# Altium schematic sheet TopLevel.SchDoc
size A
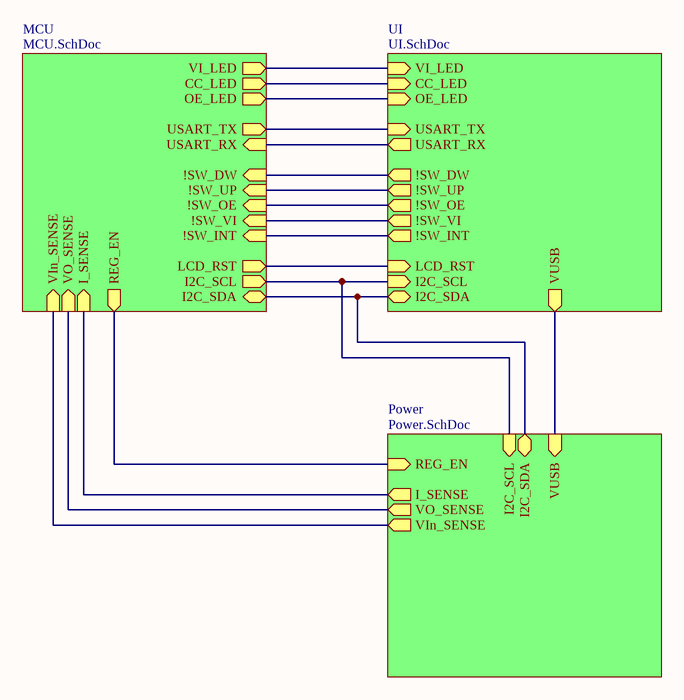
[diagram p0: TopLevel.SchDoc]

## Sub-sheets
MCU = MCU.SchDoc: REG_EN (out), CC_LED (out), OE_LED (out), USART_TX (out), USART_RX (in), !SW_DW (in), I_SENSE (in), VO_SENSE (in), VIn_SENSE (in), !SW_UP (in), !SW_OE (in), !SW_VI (in), !SW_INT (in), I2C_SCL (out), I2C_SDA (bidir), LCD_RST (out), VI_LED (out)
Power = Power.SchDoc: REG_EN (in), I_SENSE (out), VO_SENSE (out), VIn_SENSE (out), VUSB (in), I2C_SCL (in), I2C_SDA (bidir)
UI = UI.SchDoc: CC_LED (in), OE_LED (in), USART_TX (in), USART_RX (out), !SW_DW (out), !SW_UP (out), !SW_OE (out), !SW_VI (out), !SW_INT (out), LCD_RST (in), I2C_SCL (in), I2C_SDA (bidir), VUSB (out), VI_LED (in)

## Nets
(unnamed): sheet MCU/REG_EN, sheet Power/REG_EN
(unnamed): sheet MCU/CC_LED, sheet UI/CC_LED
(unnamed): sheet MCU/OE_LED, sheet UI/OE_LED
(unnamed): sheet MCU/USART_TX, sheet UI/USART_TX
(unnamed): sheet MCU/USART_RX, sheet UI/USART_RX
(unnamed): sheet MCU/!SW_DW, sheet UI/!SW_DW
(unnamed): sheet MCU/I_SENSE, sheet Power/I_SENSE
(unnamed): sheet MCU/VO_SENSE, sheet Power/VO_SENSE
(unnamed): sheet MCU/VIn_SENSE, sheet Power/VIn_SENSE
(unnamed): sheet MCU/!SW_UP, sheet UI/!SW_UP
(unnamed): sheet MCU/!SW_OE, sheet UI/!SW_OE
(unnamed): sheet MCU/!SW_VI, sheet UI/!SW_VI
(unnamed): sheet MCU/!SW_INT, sheet UI/!SW_INT
(unnamed): sheet MCU/I2C_SCL, sheet UI/I2C_SCL, sheet Power/I2C_SCL
(unnamed): sheet MCU/I2C_SDA, sheet UI/I2C_SDA, sheet Power/I2C_SDA
(unnamed): sheet MCU/LCD_RST, sheet UI/LCD_RST
(unnamed): sheet MCU/VI_LED, sheet UI/VI_LED
(unnamed): sheet UI/VUSB, sheet Power/VUSB